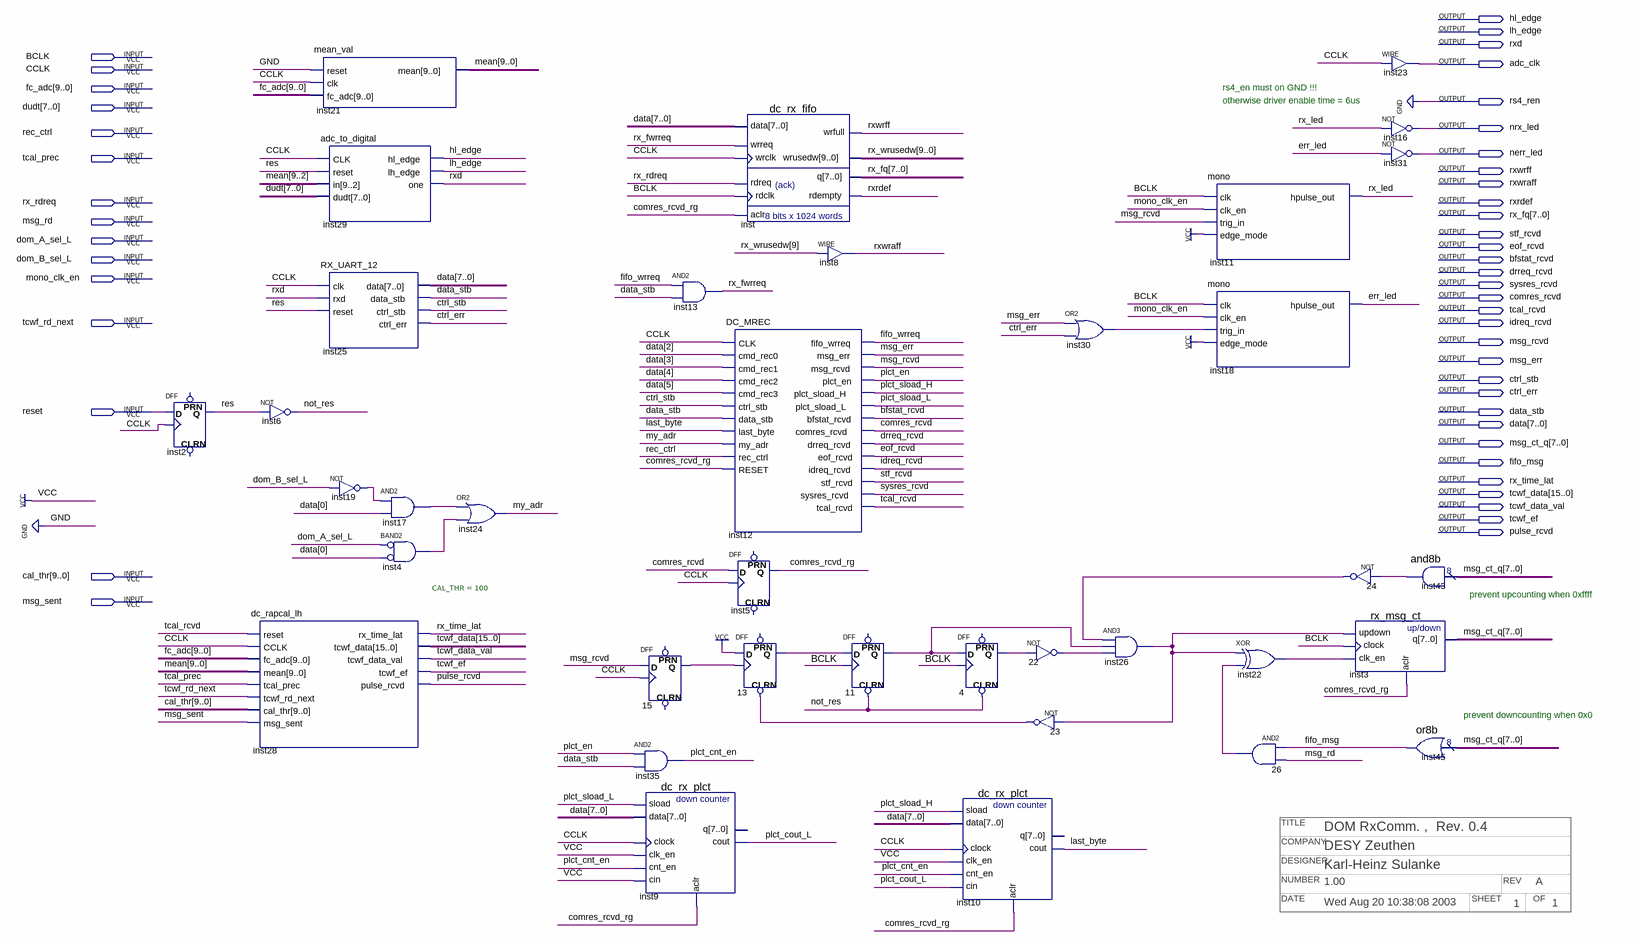
[diagram p0: schematic sheet]
// Quartus schematic DC_Rx_chan_04_DOR.bdf as structural Verilog: 37 symbols, 47 pins
// Title block: TITLE: DOM RxComm. ,  Rev. 0.4; COMPANY: DESY Zeuthen; DESIGNER: Karl-Heinz Sulanke; NUMBER: 1.00; REV: A; DATE: Wed Aug 20 10:38:08 2003; SHEET: 1; OF: 1
module DC_Rx_chan_04_DOR (
  input  BCLK,
  input  CCLK,
  input  [9:0] fc_adc,
  input  [7:0] dudt,
  input  rec_ctrl,
  input  tcal_prec,
  input  rx_rdreq,
  input  msg_rd,
  input  dom_A_sel_L,
  input  dom_B_sel_L,
  input  mono_clk_en,
  input  tcwf_rd_next,
  input  reset,
  input  [9:0] cal_thr,
  input  msg_sent,
  output hl_edge,
  output lh_edge,
  output rxd,
  output adc_clk,
  output rs4_ren,
  output nrx_led,
  output nerr_led,
  output rxwrff,
  output rxwraff,
  output rxrdef,
  output [7:0] rx_fq,
  output stf_rcvd,
  output eof_rcvd,
  output bfstat_rcvd,
  output drreq_rcvd,
  output sysres_rcvd,
  output comres_rcvd,
  output tcal_rcvd,
  output idreq_rcvd,
  output msg_rcvd,
  output msg_err,
  output ctrl_stb,
  output ctrl_err,
  output data_stb,
  output [7:0] data,
  output [7:0] msg_ct_q,
  output fifo_msg,
  output rx_time_lat,
  output [15:0] tcwf_data,
  output tcwf_data_val,
  output tcwf_ef,
  output pulse_rcvd
);

  wire comres_rcvd_rg, err_led, fifo_wrreq, inst4_out, inst17_out, inst19_out, inst22_out, inst26_out,
       inst30_out, inst43_result, last_byte, my_adr, n4_q, n11_q, n13_q, n15_q, n22_out, n23_out, n24_out,
       n26_out, not_res, plct_cnt_en, plct_cout_L, plct_en, plct_sload_H, plct_sload_L, res, rx_fwrreq,
       rx_led;
  wire [9:0] mean, rx_wrusedw;

  DFF inst2 (.CLK(CCLK), .D(reset), .Q(res));  // open: CLRN, PRN
  not inst6 (not_res, res);
  dc_rapcal_lh #(.CAL_THR(100)) inst28 (
    .reset(tcal_rcvd), .CCLK(CCLK), .fc_adc(fc_adc), .mean(mean), .tcal_prec(tcal_prec),
    .tcwf_rd_next(tcwf_rd_next), .cal_thr(cal_thr), .msg_sent(msg_sent), .rx_time_lat(rx_time_lat),
    .tcwf_data(tcwf_data), .tcwf_data_val(tcwf_data_val), .tcwf_ef(tcwf_ef), .pulse_rcvd(pulse_rcvd));
  mean_val inst21 (.reset(1'b0), .clk(CCLK), .fc_adc(fc_adc), .mean(mean));
  adc_to_digital inst29 (
    .CLK(CCLK), .reset(res), .in(mean[9:2]), .dudt(dudt), .hl_edge(hl_edge), .lh_edge(lh_edge), .one(rxd));
  RX_UART_12 inst25 (
    .clk(CCLK), .rxd(rxd), .reset(res), .data(data), .data_stb(data_stb), .ctrl_stb(ctrl_stb),
    .ctrl_err(ctrl_err));
  not inst19 (inst19_out, dom_B_sel_L);
  and inst17 (inst17_out, inst19_out, data[0]);
  and inst4 (inst4_out, ~dom_A_sel_L, ~data[0]);  // BAND2
  or inst24 (my_adr, inst17_out, inst4_out);
  DFF u_15 (.CLK(CCLK), .D(msg_rcvd), .Q(n15_q));  // open: CLRN, PRN
  and inst35 (plct_cnt_en, plct_en, data_stb);
  dc_rx_plct inst9 (
    .sload(plct_sload_L), .data(data), .clock(CCLK), .clk_en(1'b1), .cnt_en(plct_cnt_en), .cin(1'b1),
    .aclr(comres_rcvd_rg), .cout(plct_cout_L));  // open: q
  and inst13 (rx_fwrreq, fifo_wrreq, data_stb);
  dc_rx_fifo inst (
    .data(data), .wrreq(rx_fwrreq), .wrclk(CCLK), .rdreq(rx_rdreq), .rdclk(BCLK), .aclr(comres_rcvd_rg),
    .wrfull(rxwrff), .wrusedw(rx_wrusedw), .q(rx_fq), .rdempty(rxrdef));
  DC_MREC inst12 (
    .CLK(CCLK), .cmd_rec0(data[2]), .cmd_rec1(data[3]), .cmd_rec2(data[4]), .cmd_rec3(data[5]),
    .ctrl_stb(ctrl_stb), .data_stb(data_stb), .last_byte(last_byte), .my_adr(my_adr), .rec_ctrl(rec_ctrl),
    .RESET(comres_rcvd_rg), .fifo_wrreq(fifo_wrreq), .msg_err(msg_err), .msg_rcvd(msg_rcvd),
    .plct_en(plct_en), .plct_sload_H(plct_sload_H), .plct_sload_L(plct_sload_L), .bfstat_rcvd(bfstat_rcvd),
    .comres_rcvd(comres_rcvd), .drreq_rcvd(drreq_rcvd), .eof_rcvd(eof_rcvd), .idreq_rcvd(idreq_rcvd),
    .stf_rcvd(stf_rcvd), .sysres_rcvd(sysres_rcvd), .tcal_rcvd(tcal_rcvd));
  DFF inst5 (.CLK(CCLK), .D(comres_rcvd), .Q(comres_rcvd_rg));  // open: CLRN, PRN
  DFF u_13 (.CLRN(n23_out), .CLK(n15_q), .D(1'b1), .Q(n13_q));  // open: PRN
  assign rxwraff = rx_wrusedw[9];  // WIRE inst8
  DFF u_11 (.CLRN(not_res), .CLK(BCLK), .D(n13_q), .Q(n11_q));  // open: PRN
  DFF u_4 (.CLRN(not_res), .CLK(BCLK), .D(n11_q), .Q(n4_q));  // open: PRN
  dc_rx_plct inst10 (
    .sload(plct_sload_H), .data(data), .clock(CCLK), .clk_en(1'b1), .cnt_en(plct_cnt_en), .cin(plct_cout_L),
    .aclr(comres_rcvd_rg), .cout(last_byte));  // open: q
  or inst30 (inst30_out, msg_err, ctrl_err);
  not u_22 (n22_out, n4_q);
  not u_23 (n23_out, inst26_out);
  and inst26 (inst26_out, n24_out, n11_q, n22_out);
  mono inst11 (.clk(BCLK), .clk_en(mono_clk_en), .trig_in(msg_rcvd), .edge_mode(1'b1), .hpulse_out(rx_led));
  mono inst18 (.clk(BCLK), .clk_en(mono_clk_en), .trig_in(inst30_out), .edge_mode(1'b1), .hpulse_out(err_led));
  xor inst22 (inst22_out, inst26_out, n26_out);
  and u_26 (n26_out, fifo_msg, msg_rd);
  not u_24 (n24_out, inst43_result);
  rx_msg_ct inst3 (.updown(inst26_out), .clock(BCLK), .clk_en(inst22_out), .aclr(comres_rcvd_rg), .q(msg_ct_q));
  assign adc_clk = CCLK;  // WIRE inst23
  not inst16 (nrx_led, rx_led);
  not inst31 (nerr_led, err_led);
  and8b inst43 (.data(msg_ct_q), .result(inst43_result));
  or8b inst45 (.data(msg_ct_q), .result(fifo_msg));

  assign rs4_ren = 1'b0;

  // Notes on the sheet:
  //   rs4_en must on GND !!!
  //   otherwise driver enable time = 6us
  //   prevent upcounting when 0xffff
  //   prevent downcounting when 0x0
endmodule
